# Altium schematic sheet Schematic.SchDoc
size Tabloid; SheetNumber: 1; SheetTotal: 1; SPICEModelCacheTCWTLRCC: <root> / <DocumentId>TCWTLRCC</DocumentId> / <CacheFrame Number="0"> / <Model Name="fuse" Kind="CKT"> / <Text>.SUBCKT FUSE 1 2 PARAMS: CURRENT=1 RESISTANCE=1m / SW1 1 2 3 0 SMOD OFF / BNLV 3 0 V=(abs(v(1,2))) / .MODEL SMOD SW (VT={(CURRENT*RESISTANCE)} RON=1g ROFF={RESISTANCE}) / .ENDS FUSE</Text> / </Model> / <Model Name="led0" Kind="MDL"> / <Text>*Typ INFRARED GaAs LED: Vf=1.2V Vr=5V If=40mA trr=3uS / *LED Pinout: 1=A, 2=K / .MODEL LED0 D (IS=93.5P RS=84M N=2.63 BV=5 IBV=10U / + CJO=2.97P VJ=.75 M=.333 TT=4.32U)</Text> / </Model> / <Model Name="zener" Kind="MDL"> / <Text>*ZENER / *Default Zener 10V @ 10mA / *Zener Diode Pinout: A,K / .MODEL ZENER D( BV=10 IBV=10E-3 )</Text> / </Model> / </CacheFrame> / </root>
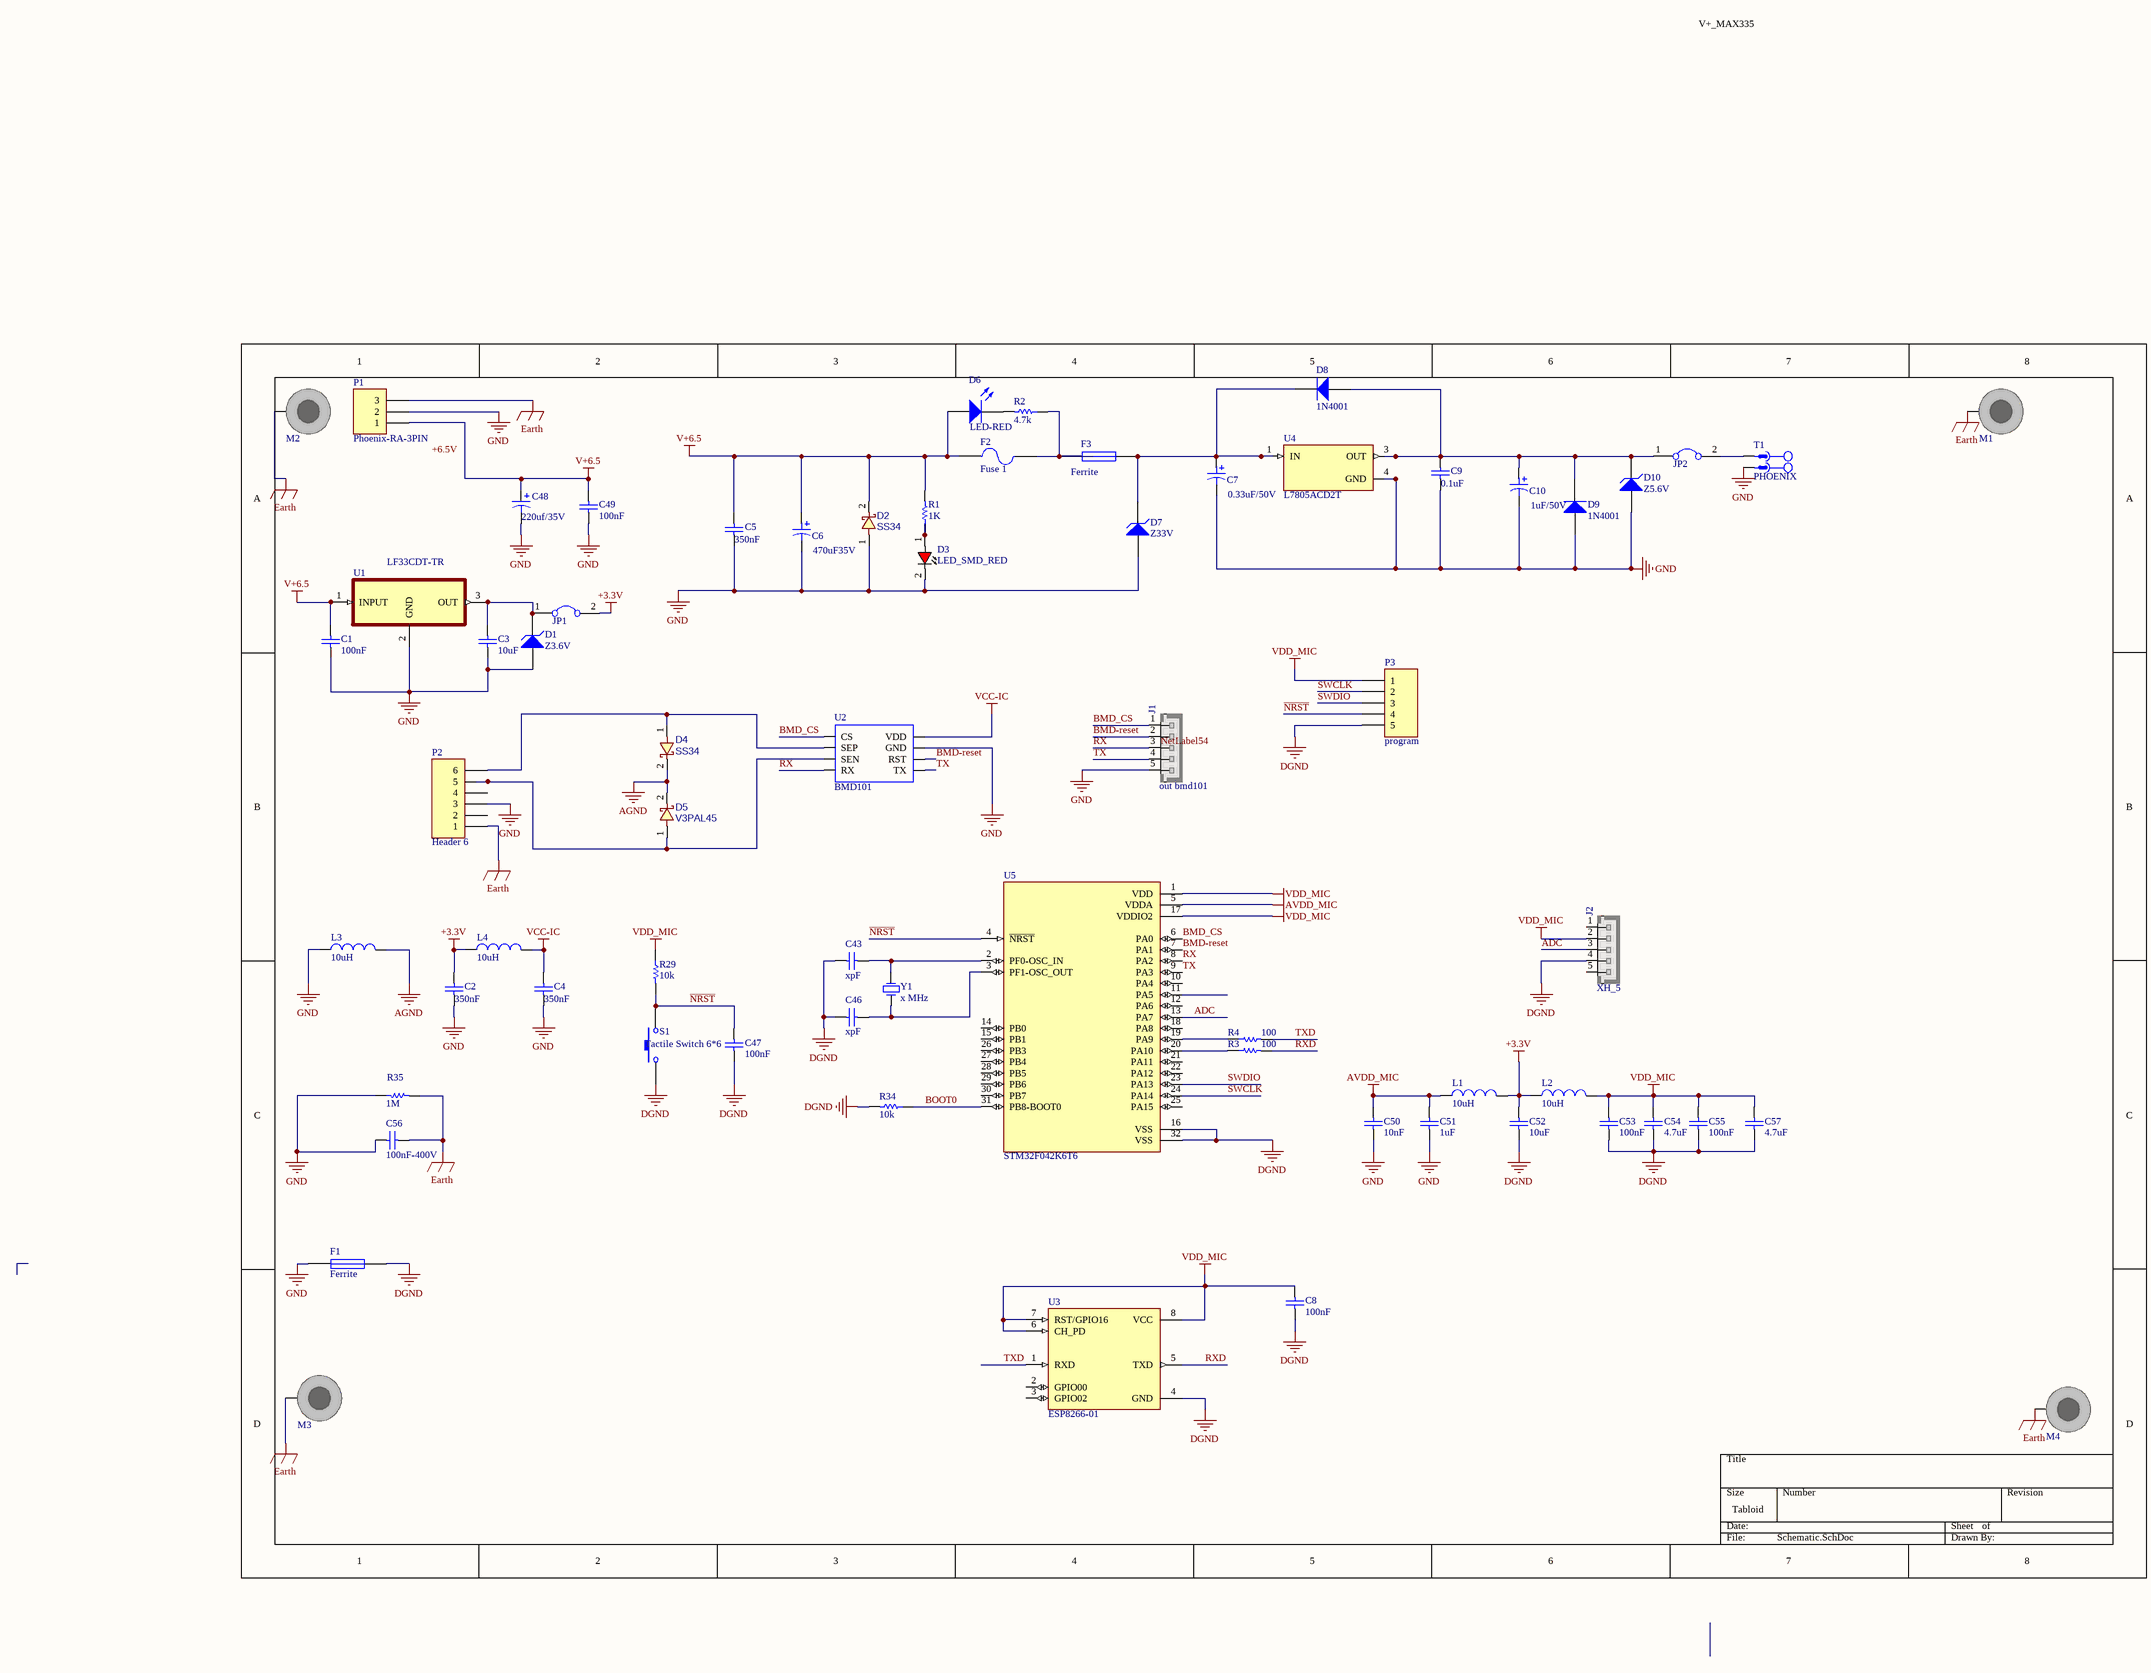
[diagram p0: Schematic.SchDoc]

## Parts
C1  100nF  [C0603]
C2  350nF  [C0603]
C3  10uF  [C0603E]
C4  350nF  [C0603]
C5  350nF  [C0603]
C6  470uF35V  [C_EL_10_10]
C7  0.33uF/50V  [C_EL_10_10]
C8  100nF  [C0603]
C9  0.1uF  [C0603]
C10  1uF/50V  [C_EL_10_10]
C43  xpF  [C0603]
C46  xpF  [C0603]
C47  100nF  [C0603]
C48  220uf/35V  [C_EL_10_10]
C49  100nF  [C0603]
C50  10nF  [L0603]
C51  1uF  [C0603]
C52  10uF  [L0603]
C53  100nF  [C0603]
C54  4.7uF  [C0603]
C55  100nF  [C0603]
C56  100nF-400V  [C_CER_D7B]
C57  4.7uF  [C0603]
D1  Z3.6V  [D_SOD80]
D2  SS34  [D_SMB]
D3  LED_SMD_RED  [LED1206RED]
D4  SS34  [D_SMB]
D5  V3PAL45  [D_SMB]
D6  LED-RED  [LED1206RED]
D7  Z33V  [D_SOD80]
D8  1N4001  [D_SMA]
D9  1N4001  [D_SMA]
D10  Z5.6V  [D_SOD80]
F1  Ferrite  [CAPP 1206 (3216X18L) Size A]
F2  Fuse 1  [1206 FUSE]
F3  Ferrite  [CAPP 1206 (3216X18L) Size A]
J1  out bmd101  [HDR_M_1X5]
J2  XH_5  [HDR_F_1X5]
JP1  Jumper  [HDR_M_1X2]  (value not drawn)
JP2  Jumper  [HDR_M_1X2]  (value not drawn)
L1  10uH  [L0603]
L2  10uH  [L0603]
L3  10uH  [L0603]
L4  10uH  [L0603]
M1  DNP/MH  [SCMH_M2]  (value not drawn)  (no BOM)
M2  DNP/MH  [SCMH_M2]  (value not drawn)  (no BOM)
M3  DNP/MH  [SCMH_M2]  (value not drawn)  (no BOM)
M4  DNP/MH  [SCMH_M2]  (value not drawn)  (no BOM)
P1  Phoenix-RA-3PIN  [PWL_3]
P2  Header 6  [HDR_M_1X6]
P3  program  [HDR_M_1X5]
R1  1K  [R0603]
R2  4.7k  [R0603]
R3  100  [R0603]
R4  100  [R0603]
R29  10k  [R0603]
R34  10k  [R0603]
R35  1M  [R0805]
S1  Tactile Switch 6*6  [SW-PB]
T1  PHOENIX  [PWL_2]
U1  LF33CDT-TR  [LF33_2]
U2  BMD101  [SON50P305X300X55-9T180X220N]
U3  ESP8266-01  [ESP8266-01]
U4  L7805ACD2T  [TO-252]
U5  STM32F042K6T6  [My_32A_M]
Y1  x MHz  [Crystal SMD]

## Nets
+3.3V: C2.2 C52.1 JP1.2 L1.2 L2.1 L4.1
AGND: D4.2 D5.2 L3.2
AVDD_MIC: C50.2 C51.1 L1.1 U5.5(VDDA)
DGND: C8.1 C43.2 C46.2 C47.2 C52.2 C53.1 C54.1 C55.1 C57.1 F1.2 J2.4 P3.5 R34.2 S1.1 U3.4(GND) U5.16(VSS) U5.32(VSS)
Earth: C56.2 M1.1 M2.1 M3.1 M4.1 P1.3 P2.1 R35.2
GND: C1.2 C2.1 C3.2 C4.1 C5.1 C6.2 C7.2 C9.1 C10.2 C48.2 C49.1 C50.1 C51.2 C56.1 D1.1(A) D2.1 D3.2(CATHODE) D7.1(A) D9.1(A) D10.1(A) F1.1 J1.5 L3.1 P1.2 P2.3 R35.1 T1.2 U1.2(GND) U2.7(GND) U4.4(GND)
V+6.5: C1.1 C5.2 C6.1 C48.1 C49.2 D2.2 D6.1(A) F2.1 P1.1 R1.2 U1.1(INPUT)
VCC-IC: C4.2 L4.2 U2.8(VDD)
VDD_MIC: C8.2 C53.2 C54.2 C55.2 C57.2 J2.2 L2.2 P3.1 R29.1 U3.6(CH_PD) U3.7(RST/GPIO16) U3.8(VCC) U5.1(VDD) U5.17(VDDIO2)
ADC: J2.3 U5.13(PA7)
BMD-reset: J1.2 U2.6(RST) U5.7(PA1)
BMD_CS: J1.1 U2.1(CS) U5.6(PA0)
BOOT0: R34.1 U5.31(PB8-BOOT0)
~{NRST}: C47.1 P3.4 R29.2 S1.2 U5.4(~{NRST})
RX: J1.3 U2.4(RX) U5.8(PA2)
RXD: R3.2 U3.5(TXD)
SWCLK: P3.2 U5.24(PA14)
SWDIO: P3.3 U5.23(PA13)
TX: J1.4 U2.5(TX) U5.9(PA3)
TXD: R4.2 U3.1(RXD)
NetC3_1: C3.1 D1.2(K) JP1.1 U1.3(OUT)
NetC7_1: C7.1 D7.2(K) D8.2(K) F3.2 U4.1(IN)
NetC9_2: C9.2 C10.1 D8.1(A) D9.2(K) D10.2(K) JP2.1 U4.3(OUT)
NetC43_1: C43.1 U5.2(PF0-OSC_IN) Y1.2(OSC2)
NetC46_1: C46.1 U5.3(PF1-OSC_OUT) Y1.1(OSC1)
NetD3_1: D3.1(ANODE) R1.1
NetD4_1: D4.1 P2.6 U2.2(SEP)
NetD5_1: D5.1 P2.5 U2.3(SEN)
NetD6_2: D6.2(K) R2.2
NetF2_2: F2.2 F3.1 R2.1
NetJP2_2: JP2.2 T1.1
NetR3_1: R3.1 U5.20(PA10)
NetR4_1: R4.1 U5.19(PA9)

Not connected (* = marked no-connect by the designer): J2 1 5; P2 2 4; U3 2(GPIO00) 3(GPIO02); U5 10(PA4) 11(PA5) 12(PA6) 14(PB0) 15(PB1) 18(PA8) 21(PA11) 22(PA12) 25(PA15) 26(PB3) 27(PB4) 28(PB5) 29(PB6) 30(PB7)

## Notes on the sheet
- V+_MAX335
- +6.5V
- Labels drawn without touching a wire or pin: NetLabel54

## Library data of the parts
C1-C5 C8 C9 C47 C51-C53 C55 C56 = Cap: Capacitor; Published: 8-Jun-2000; LatestRevisionDate: 17-Jul-2002; LatestRevisionNote: Re-released for DXP Platform.; PackageReference: RAD-0.3; Publisher: Altium Limited; PackageDescription: Radial Cap, Thru-Hole; 2 Leads; 0.3 in Pin Spacing
  C1 C8 C47 C53 C55: Value: 100nF
  C2 C4 C5: Value: 350nF
  C3 C52: Value: 10uF
  C9: Value: 0.1uF
  C51: Value: 1uF
  C56: Value: 100nF-400V
C6 C7 C10 = Cap ELECTROLITIC TOTAL SIZE: Cap electrolitic radial; Designer: Abbas Basereh; VALUE: 100uF50V; Data: 16-12-2016; Part. No: *
C43 C46 C49 = CAP SMD PACKAGE: TOTAL CAPACITOR SMD PACK; Designer: Abbas Basereh; Desc.: CAP SMD TOTAL PACKAGES; Data: 2017-3-10
  C43 C46: VALUE: xpF
  C49: VALUE: 100nF
C48 = Cap Pol1: Polarized Capacitor (Radial); Value: 100uF-35V; Published: 8-Jun-2000; LatestRevisionDate: 17-Jul-2002; LatestRevisionNote: Re-released for DXP Platform.; PackageReference: RB7.6-15; Publisher: Altium Limited; PackageDescription: Polarized Capacitor (Radial); 2 Leads
C50 C54 C57 = Cap: Capacitor; Value: 100nF; Published: 8-Jun-2000; LatestRevisionDate: 17-Jul-2002; LatestRevisionNote: Re-released for DXP Platform.; PackageReference: RAD-0.3; Publisher: Altium Limited; PackageDescription: Radial Cap, Thru-Hole; 2 Leads; 0.3 in Pin Spacing
D1 D7 D10 = D Zener: Zener Diode; Published: 8-Jun-2000; LatestRevisionDate: 17-Jul-2002; LatestRevisionNote: Re-released for DXP Platform.; PackageReference: DIODE-0.7; Publisher: Altium Limited
  D1 D10: PackageDescription: Diode, Thru-Hole; 2 Leads; 0.7 in Pin Spacing
D2 D4 = DIODE_SMD_SCHOTTKY_SS34: DIODE, SCHOTTKY, 20V, 3A; MANF: VISHAY; DESC: DESCRIPTION; MANF_P#: SS34; ASSEMBLY: ASSEMBLY; PRICE: PRICE; PARAM2: 3A; PARAM: 20V; VALUE: SS34
D3 = LED_SMD_RED: LED, SMD, RED; PARAM: *; MANF: *; ASSEMBLY: *; PRICE: *; DESC: *; MANF_P#: *; PARAM2: *; VALUE: *
D5 = DIODE_SMD_SCHOTTKY_V3PAL45: DIODE, SCHOTTKY, 45V, 3A; MANF: VISHAY; MANF_P#: V3PAL45HM3_A/I; DESC: DESCRIPTION; PARAM2: 45Vr, 0.46Vf; PARAM: 3A, -40~150oC; ASSEMBLY: ASSEMBLY; PRICE: 0.6$; VALUE: V3PAL45
D6 = LED0: Typical INFRARED GaAs LED; Published: 8-Jun-2000; LatestRevisionDate: 08-Jul-2005; LatestRevisionNote: Mech Layer 1 removed.; PackageReference: LED-0; Publisher: Altium Limited
D8 D9 = Diode 1N4148: High Conductance Fast Diode; Published: 8-Jun-2000; LatestRevisionDate: 17-Jul-2002; LatestRevisionNote: Re-released for DXP Platform.; DatasheetVersion: 1997; PackageReference: DO-35; Publisher: Altium Limited; PackageDescription: Diode, Axial; Body 3.8 x 1.9 mm (LxDia. max), Lead Dia. 0.53 mm (max); Code_JEDEC: DO-204-AH; ComponentLink1Description: Manufacturer Link; ComponentLink1URL: http://www.fairchildsemi.com/; ComponentLink2Description: Datasheet; ComponentLink2URL: http://www.fairchildsemi.com/ds/1N%2F1N4148.pdf
F1 F3 = Fuse 1: Fuse; Published: 8-Jun-2000; LatestRevisionDate: 17-Jul-2002; LatestRevisionNote: Re-released for DXP Platform.; PackageReference: PIN-W2/E2.8; Publisher: Altium Limited
  F1: PackageDescription: Thru-Hole; 2 Leads
F2 = Fuse 2: Fuse; Published: 8-Jun-2000; LatestRevisionDate: 17-Jul-2002; LatestRevisionNote: Re-released for DXP Platform.; PackageReference: PIN-W2/E2.8; Publisher: Altium Limited
J1 J2 = XH_5: JST-XH pitch: 2.5mm; MANF_P#: JST-B5B-XHA; MANF: JST
  J1: VALUE: out bmd101
  J2: VALUE: XH_5
JP1 JP2 = Jumper: Company: E.P.I.L; Defualt State: Close; Design Date: 2011/11/02
L1-L4 = Inductor: Code_IEC: 1005; Published: 8-Jun-2000; LatestRevisionDate: 29-May-2009; LatestRevisionNote: IPC-7351 Footprint Added.; PackageReference: 0402-A; Publisher: Altium Limited; PackageDescription: Chip Inductor; Code_JEITA: 0402; Value: 10uH
M1-M4 = SCMH_M3FT: SCREW mouting, M3, 3.0mm diameter and 6.0mm, FlatHead; ASSEMBLY: DNP; VALUE: DNP/MH
P1 = Header 3: Phoenix; LatestRevisionDate: 17-Jul-2002; LatestRevisionNote: Re-released for DXP Platform.; Publisher: Altium Limited
P2 = Header 6: Header, 6-Pin; LatestRevisionDate: 17-Jul-2002; LatestRevisionNote: Re-released for DXP Platform.; Publisher: Altium Limited
P3 = Header 5: Header, 5-Pin; LatestRevisionDate: 17-Jul-2002; LatestRevisionNote: Re-released for DXP Platform.; Publisher: Altium Limited
R1-R4 = RES 0805 0.125W: RES 0805; Designer: Abbas Basereh; Desc.: RES SMD 0805; Data: 16-12-2016
R29 R34 = Res1: Resistor; Value: 4.7R; Published: 8-Jun-2000; LatestRevisionDate: 17-Jul-2002; LatestRevisionNote: Re-released for DXP Platform.; PackageReference: AXIAL-0.3; Publisher: Altium Limited; PackageDescription: Axial Device, Thru-Hole; 2 Leads; 0.3 in Pin Spacing
R35 = Res1: Resistor; Published: 8-Jun-2000; LatestRevisionDate: 17-Jul-2002; LatestRevisionNote: Re-released for DXP Platform.; PackageReference: AXIAL-0.3; Publisher: Altium Limited; Value: 1M
S1 = SW-PB: Switch; Published: 24-Mar-1999; LatestRevisionDate: 17-Jul-2002; LatestRevisionNote: Re-released for DXP Platform.; PackageReference: SPST-2; Publisher: Altium Limited; PackageDescription: Switch; 2 Leads
T1 = CON_Phoenix_MSTB_02: 2 Pitch: 5.08 mm Color: green Contact surface: Tin Assembly; Manufacturer: PHOENIX CONTACT; Connector type: PCB Terminal Block; designer: ABBAS BASEREH; Max Current: 12 A; Positions: 2; Voltage: 320 V; Category: Connector; ComponentLink1Description: Header, Nominal current: 12 A Rated voltage (III/2): 320 V Number of positions: 2 Pitch: 5.08 mm Color: green Contact surface: Tin Assembly: Soldering  DESIGNER:ABBAS BASEREH; ComponentLink2Description: Reference; Mounting Technology: Through-Hole; Pin Count: 2; Revision 1: 2017-3-1; Status: Unreleased; PART.NO: PHOENIX
U1 = LF33CDT-TR: Linear Voltage Regulator IC 1 Output 500mA DPAK; MF: STMicroelectronics; Package: TO-252-3 STMicroelectronics; Availability: Unavailable; MP: LF33CDT-TR; Value: *; SnapEDA_Link: https://www.snapeda.com/parts/LF33CDT-TR/STMicroelectronics/view-part/1049932/?ref=snap; Price: None
U2 = BMD101: BMD101 Electrocardiography (ECG/EKG) Sensor mikroBUSâ„¢ Clickâ„¢ Platform Evaluation Expansion Board; MF: MikroElektronika; Availability: Not in stock; SnapEDA_Link: https://www.snapeda.com/parts/BMD101/MikroElektronika/view-part/?ref=snap; Price: None; Package: None; Check_prices: https://www.snapeda.com/parts/BMD101/MikroElektronika/view-part/?ref=eda; Value: *; MP: BMD101
U3 = ESP8266-01: MP: ESP8266-01/ESP-01; MF: AI-Thinker; Package: None; Availability: Unavailable; Value: *; SnapEDA_Link: https://www.snapeda.com/parts/ESP8266-01/ESP-01/AI-Thinker/view-part/106413/?ref=snap; Price: None
U4 = L7805ACD2T: Linear Voltage Regulator IC 1 Output 1.5A D2PAK; MF: STMicroelectronics; Value: *; SnapEDA_Link: https://www.snapeda.com/parts/L7805ACD2T/STMicroelectronics/view-part/680973/?ref=snap; Price: None; Availability: Unavailable; Package: D2PAK STMicroelectronics; MP: L7805ACD2T
U5 = STM32F042K6T6: ARMÂ® CortexÂ®-M0 STM32F0 Microcontroller IC 32-Bit Single-Core 48MHz 32KB (32K x 8) FLASH 32-LQFP (7x7); MF: STMicroelectronics; Price: None; Availability: In Stock; MP: STM32F042K6T6; Package: LQFP-32 STMicroelectronics; SnapEDA_Link: https://www.snapeda.com/parts/STM32F042K6T6/STMicroelectronics/view-part/?ref=snap; Check_prices: https://www.snapeda.com/parts/STM32F042K6T6/STMicroelectronics/view-part/?ref=eda; Value: *; Purchase-URL: https://pricing.snapeda.com/search/part/STM32F042K6T6/?ref=eda
Y1 = XTAL: XTAL Crystal; Designer: ABBAS BASEREH; Design Date: 2017-1-3; ComponentLink1Description: Datasheet; ComponentLink2Description: Reference; Mounting Technology: Surface Mount\Through-Hole; Value: x MHz; Status: Unreleased